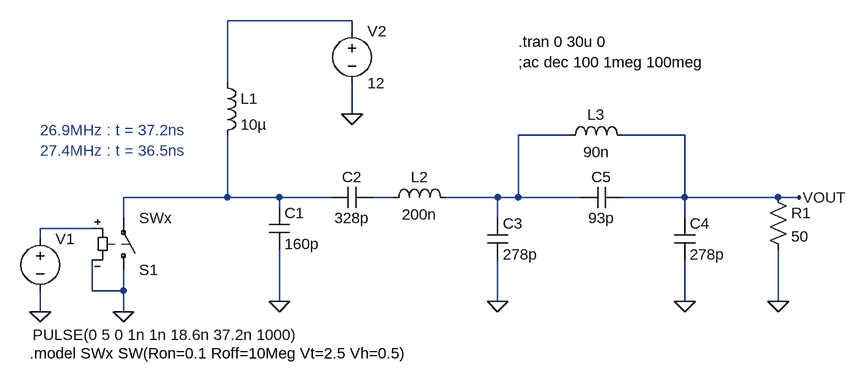
[diagram p0: schematic WA0ITP.asc]
WA0ITP.asc, the LTspice schematic file:
Version 4
SHEET 1 1900 680
WIRE 464 -144 272 -144
WIRE 464 -128 464 -144
WIRE 272 -48 272 -144
WIRE 464 0 464 -48
WIRE 800 32 720 32
WIRE 976 32 880 32
WIRE 272 128 272 32
WIRE 272 128 112 128
WIRE 352 128 272 128
WIRE 432 128 352 128
WIRE 528 128 496 128
WIRE 688 128 608 128
WIRE 720 128 720 32
WIRE 720 128 688 128
WIRE 816 128 720 128
WIRE 976 128 976 32
WIRE 976 128 880 128
WIRE 1120 128 976 128
WIRE 1152 128 1120 128
WIRE 352 144 352 128
WIRE 112 160 112 128
WIRE 688 160 688 128
WIRE 976 160 976 128
WIRE 64 176 -16 176
WIRE -16 192 -16 176
WIRE 64 272 64 224
WIRE 112 272 112 240
WIRE 112 272 64 272
WIRE 352 288 352 208
WIRE 688 288 688 224
WIRE 976 288 976 224
WIRE 1120 288 1120 208
WIRE -16 304 -16 272
WIRE 112 304 112 272
FLAG -16 304 0
FLAG 464 0 0
FLAG 112 304 0
FLAG 352 288 0
FLAG 688 288 0
FLAG 976 288 0
FLAG 1152 128 VOUT
FLAG 1120 288 0
SYMBOL voltage -16 176 R0
WINDOW 123 0 0 Left 0
WINDOW 39 0 0 Left 0
WINDOW 3 -12 164 Left 2
SYMATTR Value PULSE(0 5 0 1n 1n 18.6n 37.2n 1000)
SYMATTR InstName V1
SYMBOL voltage 464 -144 R0
WINDOW 123 0 0 Left 0
WINDOW 39 0 0 Left 0
SYMATTR InstName V2
SYMATTR Value 12
SYMBOL cap 336 144 R0
SYMATTR InstName C1
SYMATTR Value 160p
SYMBOL ind 256 -64 R0
SYMATTR InstName L1
SYMATTR Value 10µ
SYMBOL cap 496 112 R90
WINDOW 0 0 32 VBottom 2
WINDOW 3 32 32 VTop 2
SYMATTR InstName C2
SYMATTR Value 328p
SYMBOL ind 512 144 R270
WINDOW 0 32 56 VTop 2
WINDOW 3 5 56 VBottom 2
SYMATTR InstName L2
SYMATTR Value 200n
SYMBOL cap 672 160 R0
SYMATTR InstName C3
SYMATTR Value 278p
SYMBOL sw 112 256 M180
SYMATTR InstName S1
SYMATTR Value SWx
SYMBOL cap 960 160 R0
SYMATTR InstName C4
SYMATTR Value 278p
SYMBOL cap 880 112 R90
WINDOW 0 0 32 VBottom 2
WINDOW 3 32 32 VTop 2
SYMATTR InstName C5
SYMATTR Value 93p
SYMBOL ind 784 48 R270
WINDOW 0 32 56 VTop 2
WINDOW 3 5 56 VBottom 2
SYMATTR InstName L3
SYMATTR Value 90n
SYMBOL res 1104 112 R0
SYMATTR InstName R1
SYMATTR Value 50
TEXT 720 -112 Left 2 !.tran 0 30u 0
TEXT -32 368 Left 2 !.model SWx SW(Ron=0.1 Roff=10Meg Vt=2.5 Vh=0.5)
TEXT -16 24 Left 2 ;26.9MHz : t = 37.2ns
TEXT -16 56 Left 2 ;27.4MHz : t = 36.5ns
TEXT 720 -80 Left 2 !;ac dec 100 1meg 100meg

The netlist it stands for:
* WA0ITP.asc
V1 N005 0 PULSE(0 5 0 1n 1n 18.6n 37.2n 1000)
V2 N001 0 12
C1 N003 0 160p
L1 N001 N003 10µ
C2 N004 N003 328p
L2 N004 N002 200n
C3 N002 0 278p
S1 0 N003 N005 0 SWx
C4 VOUT 0 278p
C5 VOUT N002 93p
L3 N002 VOUT 90n
R1 VOUT 0 50
.tran 0 30u 0
.model SWx SW(Ron=0.1 Roff=10Meg Vt=2.5 Vh=0.5)
* 26.9MHz : t = 37.2ns
* 27.4MHz : t = 36.5ns
;ac dec 100 1meg 100meg
.backanno
.end